# EAGLE design roomba_led_pcb_v1 (EAGLE 9.6.2)
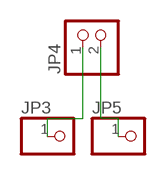
[diagram p0: schematic, sheet 1]

## Parts
JP3  PINHD-1X1  [1X01]
JP4  PINHD-1X2/90  [1X02/90]
JP5  PINHD-1X1  [1X01]

## Nets
N$1: JP3.1 JP4.1
N$2: JP4.2 JP5.1

## Library data of the parts
JP3 JP5 = pinhead_new:PINHD-1X1: PIN HEADER
JP4 = pinhead:PINHD-1X2: PIN HEADER

## Board
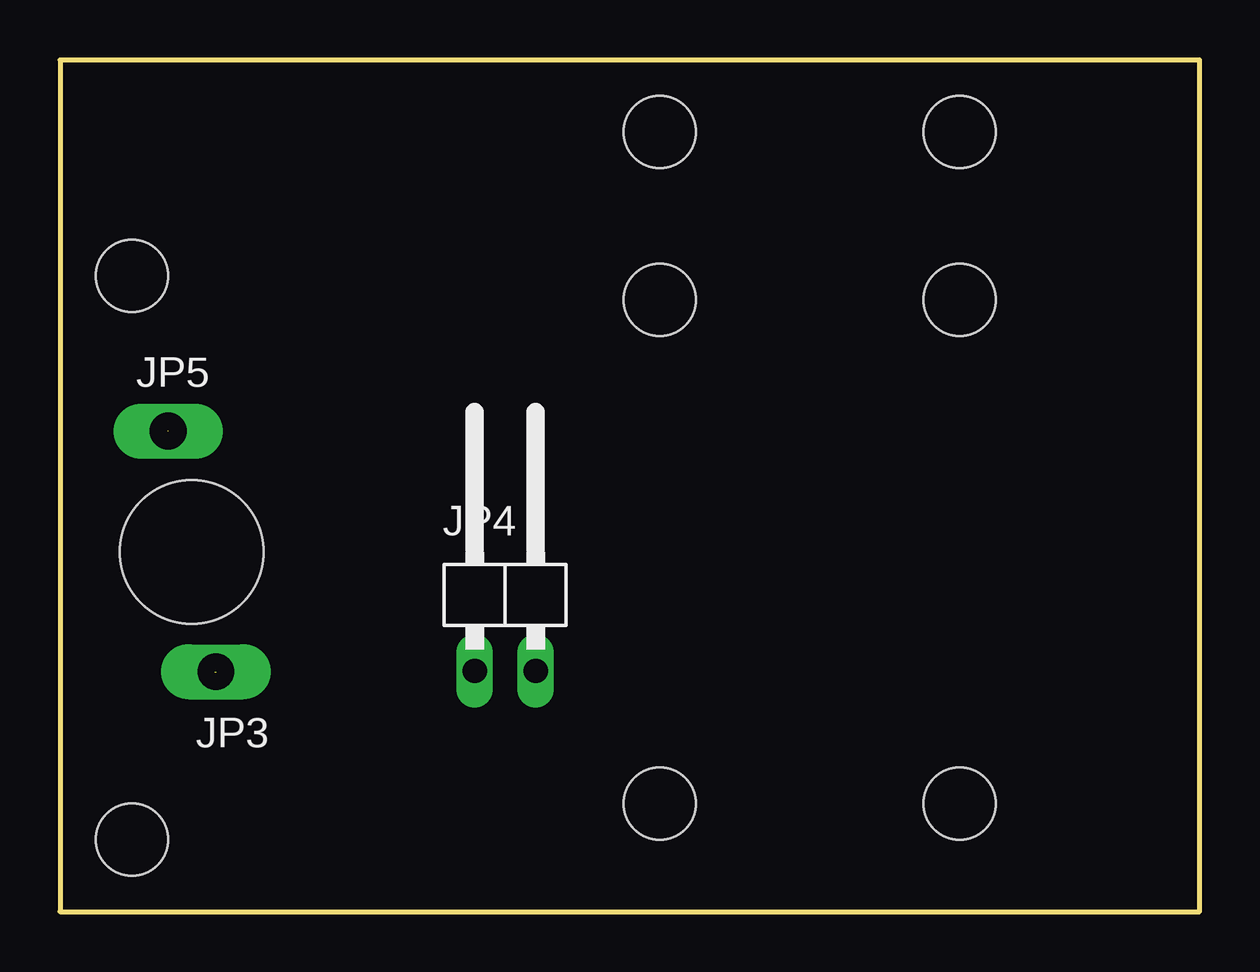
[diagram p1: board, top side]
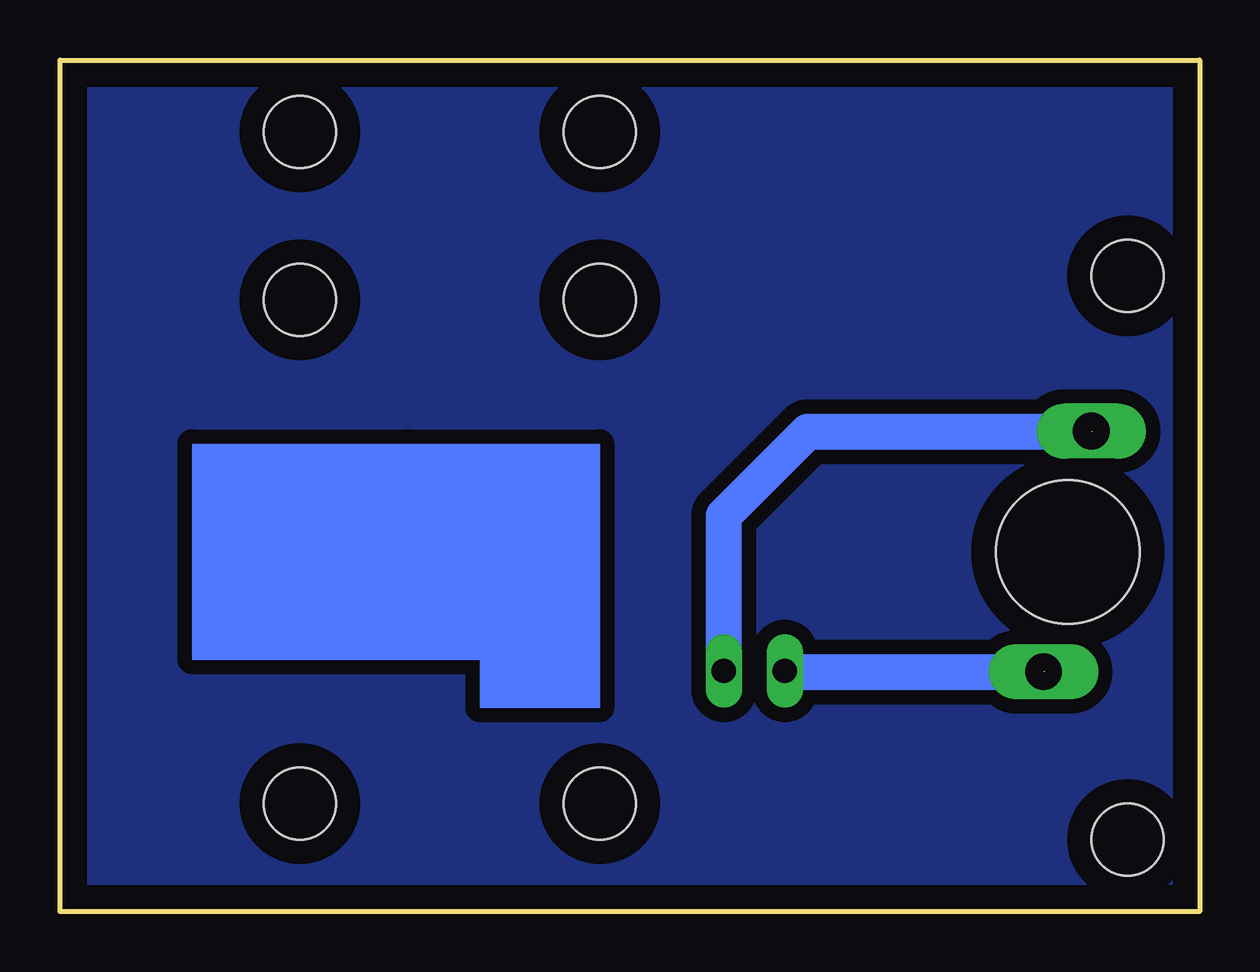
[diagram p2: board, bottom side, seen from below]

Size 47.5 x 35.5 mm. Coordinates in mm from the lower left corner, seen from the top.
Outline: 0,0 47.5,0 47.5,35.5 0,35.5 0,0
Copper layers (1*16): Top 0.035mm / dielectric 1.5mm / Bottom 0.035mm
Design rules "default": minimum track width 10mil, minimum drill 24mil, track to track 8mil, track to pad 8mil, pad to pad 8mil, via to via 8mil, smd to smd 8mil, copper to edge 40mil, drill to drill 8mil, minimum pad ring 10mil, minimum via ring 8mil, stop-mask expansion 4mil, vias tented up to drill 0mil, thermal gap 10mil
Holes 3 mm at 37.5,32.5 25,32.5 25,25.5 37.5,25.5 37.5,4.5 25,4.5 3,3 3,26.5
Holes 6 mm at 5.49,14.99

### Footprints (pad centres in the part's own frame; a part is rotated, then mirrored left to right if it is on the bottom)
1X01 = drill 1.524 long: 1 0,0
1X02/90 = drill 1.016 long: 1 -1.27,-3.81; 2 1.27,-3.81

### Placement (x,y rotation side)
JP3  6.5,10 0 top
JP4  18.56,13.84 0 top
JP5  4.51,20.03 0 top

### Tracks (layer width: path | path; a pad name or v marks a point on that pad's centre or on a via)
GND
  pour Bottom (isolate 0.6, no thermals): 47.8,35.69 -0.2,35.69 -0.2,0.19 47.8,0.19
N$1  (1 unrouted)
  Bottom 1.5: 17.25,9.99 JP4.1 17.26,10 6.44,10
N$2  (1 unrouted)
  Bottom 1.5: JP4.2 19.83,16.5 16.33,20 4.48,20
(copper drawn outside any net)
  shapes: Bottom area x3